# Altium schematic sheet хихема.SchDoc
size A2; SheetNumber: 1; SheetTotal: 6
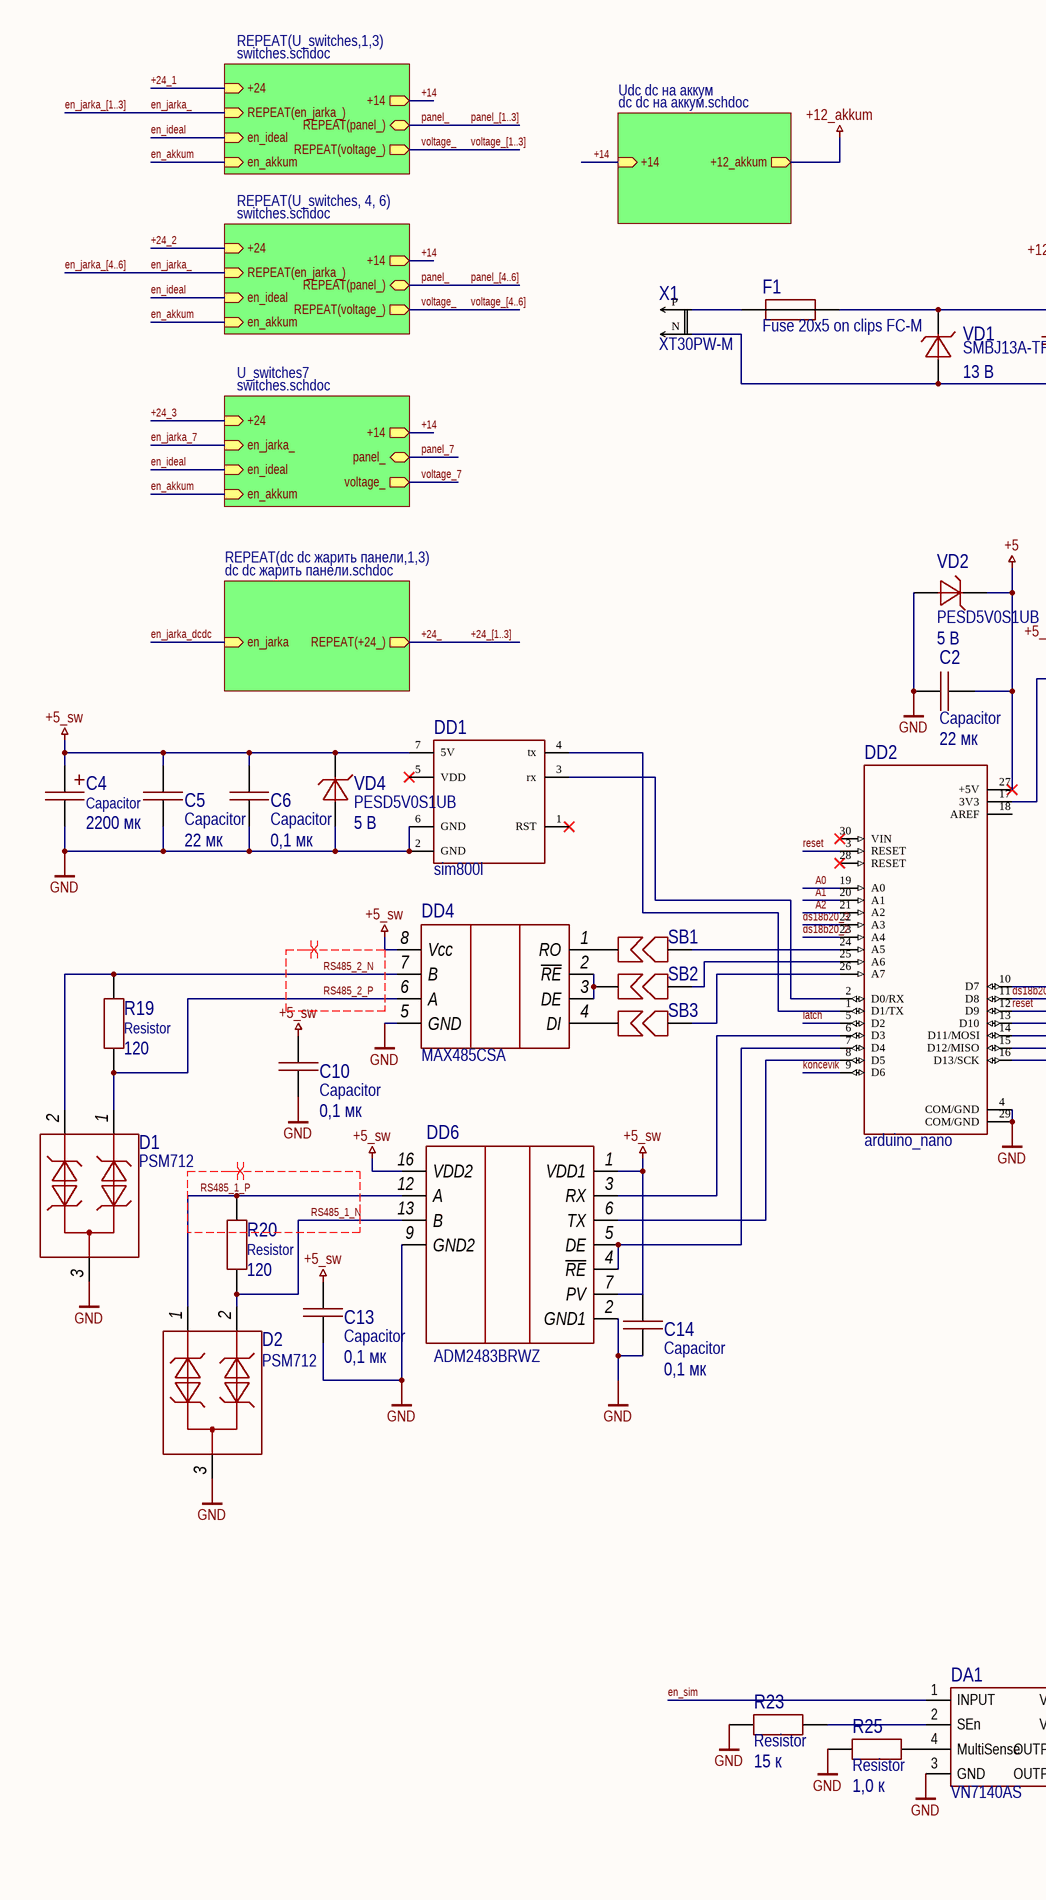
[diagram p0: хихема.SchDoc, left]
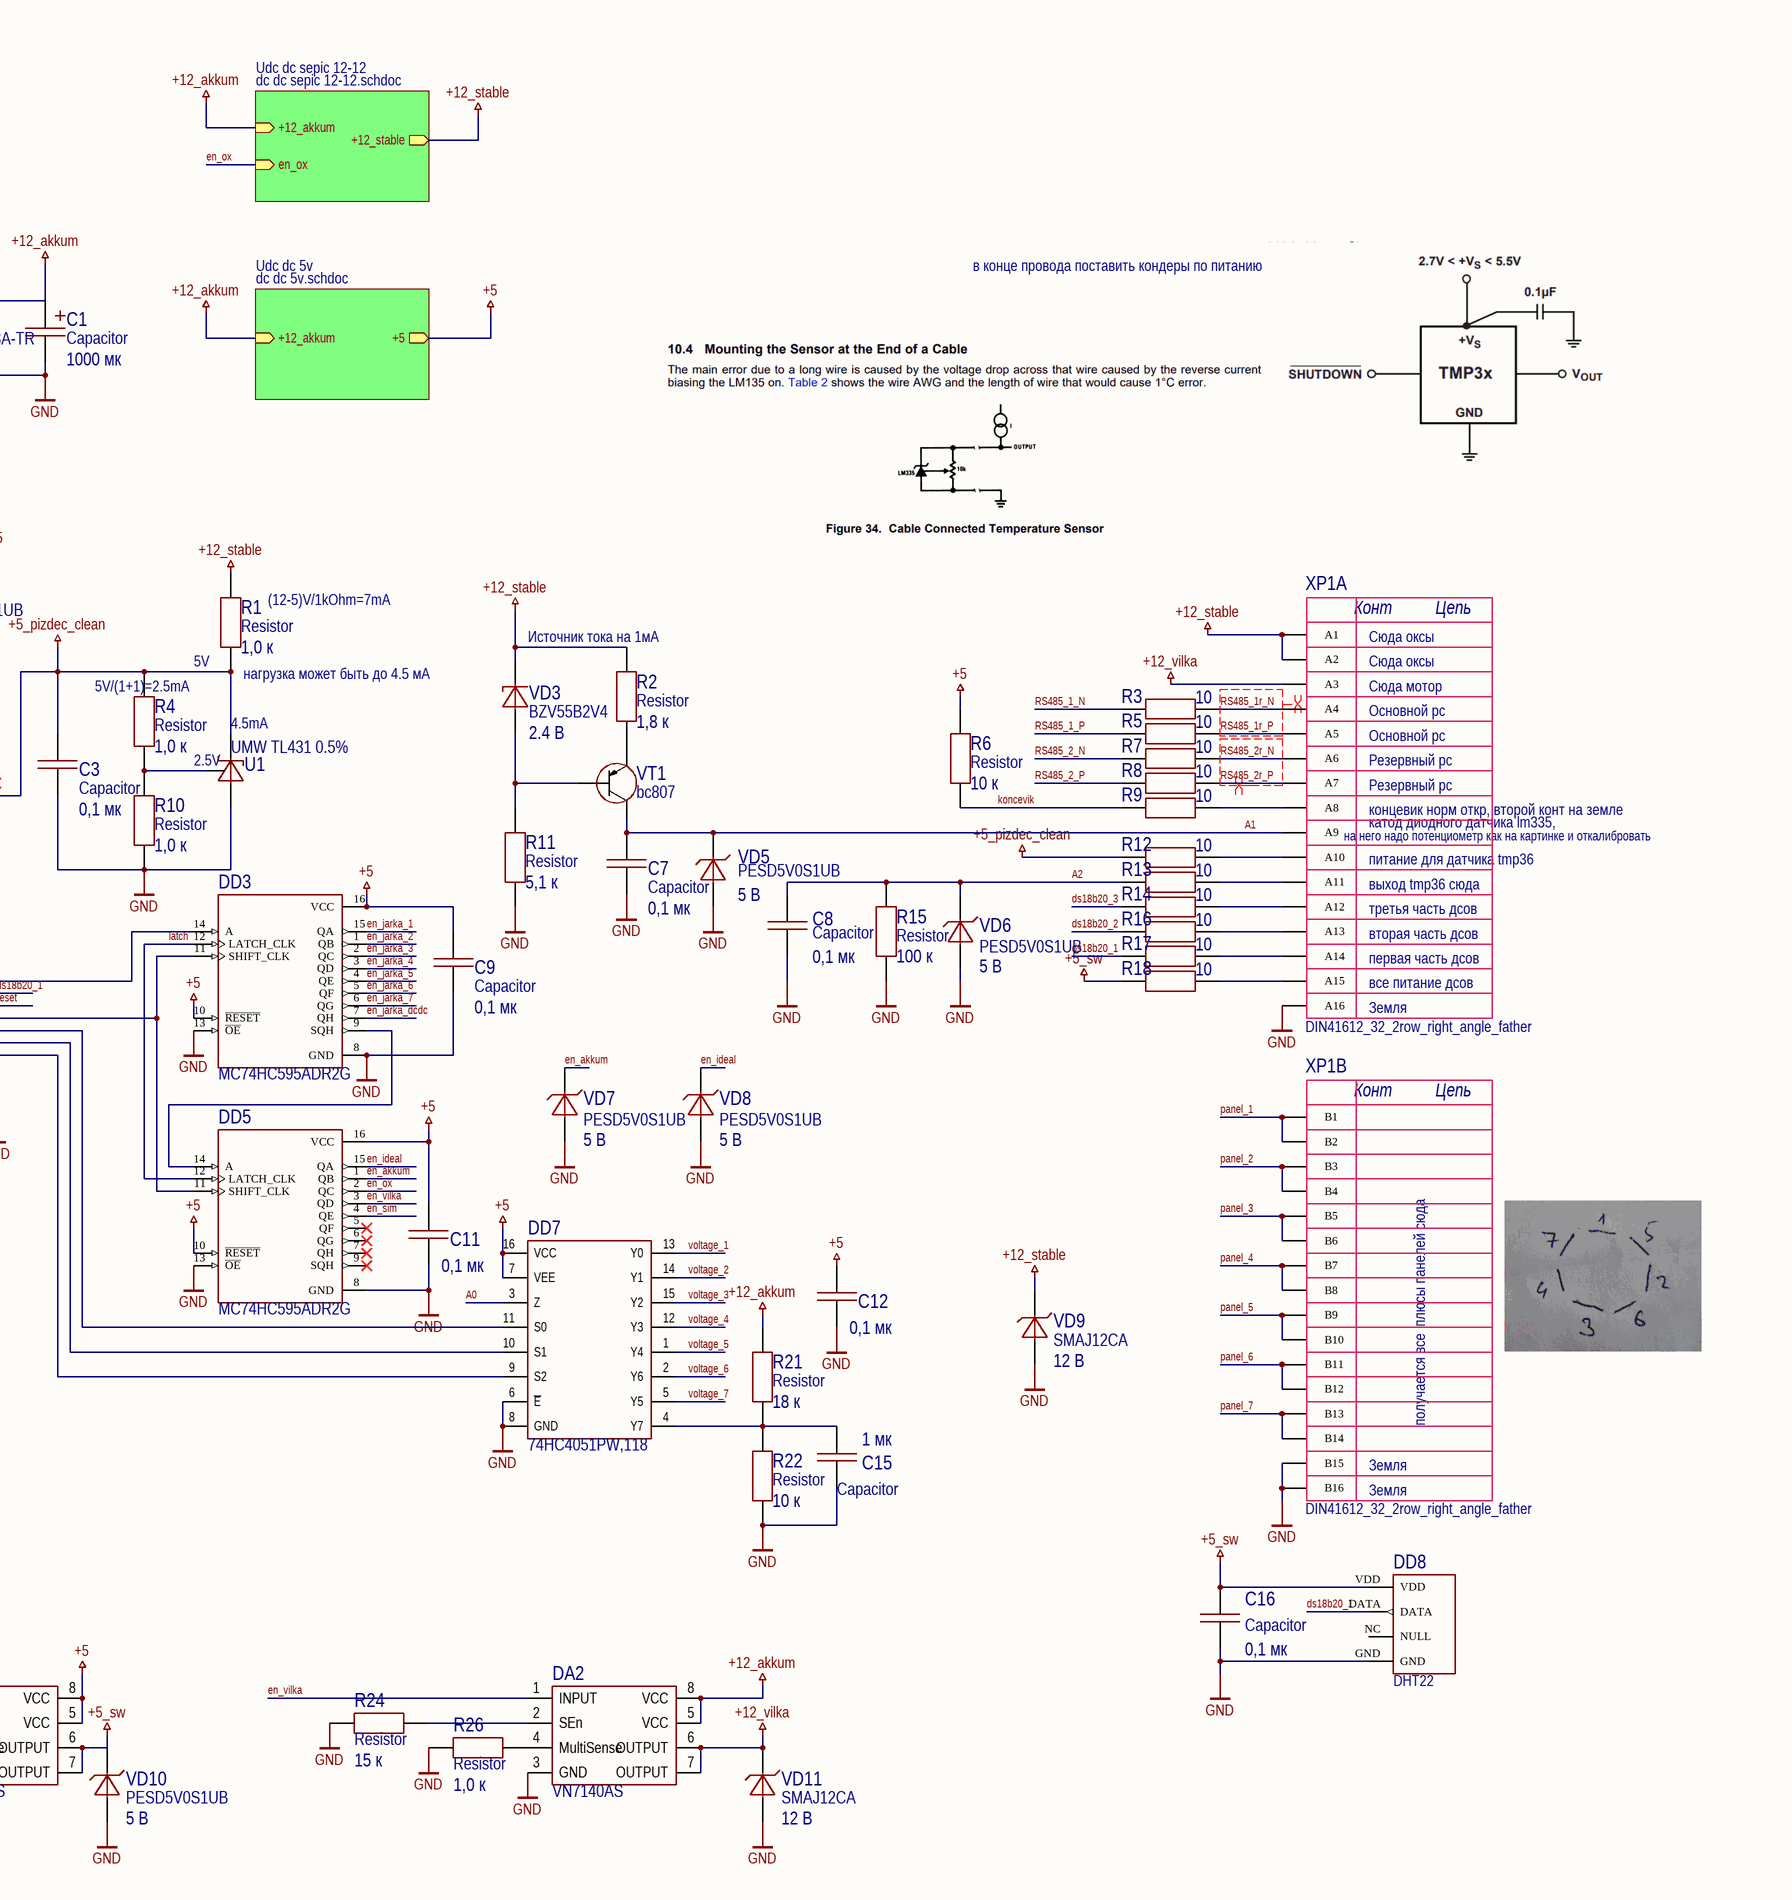
[diagram p1: хихема.SchDoc, right]

## Parts
C1  Capacitor  value 1000 мк  [SMD_cap_12,5x13,5]
C2  Capacitor  value 22 мк  [1210C]
C3  Capacitor  value 0,1 мк  [0603C]
C4  Capacitor  value 2200 мк  [10x20_radial]
C5  Capacitor  value 22 мк  [1210C]
C6  Capacitor  value 0,1 мк  [0603C]
C7  Capacitor  value 0,1 мк  [0603C]
C8  Capacitor  value 0,1 мк  [0603C]
C9  Capacitor  value 0,1 мк  [0603C]
C10  Capacitor  value 0,1 мк  [0603C]
C11  value 0,1 мк  [0603C]  (hidden comment: Capacitor)
C12  value 0,1 мк  [0603C]  (hidden comment: Capacitor)
C13  Capacitor  value 0,1 мк  [0603C]
C14  Capacitor  value 0,1 мк  [0603C]
C15  Capacitor  value 1 мк  [0603C]
C16  Capacitor  value 0,1 мк  [0603C]
D1  PSM712  [SOT23-3]
D2  PSM712  [SOT23-3]
DA1  VN7140AS  [SOP8]
DA2  VN7140AS  [SOP8]
DD1  sim800l  [sim800l]
DD2  arduino_nano  [arduino_nano]
DD3  MC74HC595ADR2G  [SOIC-16]
DD4  MAX485CSA  [SOIC-8]
DD5  MC74HC595ADR2G  [SOIC-16]
DD6  ADM2483BRWZ  [SOIC-16W]
DD7  74HC4051PW,118  [TSSOP-16]
DD8  DHT22  [DHT22]
F1  Fuse 20x5 on clips FC-M  [fuse_20x5_on_clips_FC-M]
R1  Resistor  value 1,0 к  [0603R]
R2  Resistor  value 1,8 к  [0603R]
R3  value 10  [0603R]  (hidden comment: Resistor)
R4  Resistor  value 1,0 к  [0603R]
R5  value 10  [0603R]  (hidden comment: Resistor)
R6  Resistor  value 10 к  [0603R]
R7  value 10  [0603R]  (hidden comment: Resistor)
R8  value 10  [0603R]  (hidden comment: Resistor)
R9  value 10  [0603R]  (hidden comment: Resistor)
R10  Resistor  value 1,0 к  [0603R]
R11  Resistor  value 5,1 к  [0603R]
R12  value 10  [0603R]  (hidden comment: Resistor)
R13  value 10  [0603R]  (hidden comment: Resistor)
R14  value 10  [0603R]  (hidden comment: Resistor)
R15  Resistor  value 100 к  [0603R]
R16  value 10  [0603R]  (hidden comment: Resistor)
R17  value 10  [0603R]  (hidden comment: Resistor)
R18  value 10  [0603R]  (hidden comment: Resistor)
R19  Resistor  value 120  [1206R]
R20  Resistor  value 120  [1206R]
R21  Resistor  value 18 к  [0603R]
R22  Resistor  value 10 к  [0603R]
R23  Resistor  value 15 к  [0603R]
R24  Resistor  value 15 к  [0603R]
R25  Resistor  value 1,0 к  [0603R]
R26  Resistor  value 1,0 к  [0603R]
SB1  SB  [0805SB]  (value not drawn)
SB2  SB  [0805SB]  (value not drawn)
SB3  SB  [0805SB]  (value not drawn)
U1  UMW TL431 0.5%  [SOT23-3]
VD1  SMBJ13A-TR  value 13 В  [SMB]
VD2  PESD5V0S1UB  value 5 В  [SOD523]
VD3  BZV55B2V4  value 2.4 В  [mini_MELF_3.5mm]
VD4  PESD5V0S1UB  value 5 В  [SOD523]
VD5  PESD5V0S1UB  value 5 В  [SOD523]
VD6  PESD5V0S1UB  value 5 В  [SOD523]
VD7  PESD5V0S1UB  value 5 В  [SOD523]
VD8  PESD5V0S1UB  value 5 В  [SOD523]
VD9  SMAJ12CA  value 12 В  [SMA]
VD10  PESD5V0S1UB  value 5 В  [SOD523]
VD11  SMAJ12CA  value 12 В  [SMA]
VT1  bc807  [SOT23-3]
X1  XT30PW-M  [XT30PW-M]
XP1  DIN41612_32_2row_right_angle_father  [DIN41612_32_2row_right_angle_father]  (parts A,B of 2)

## Sub-sheets
REPEAT(dc dc жарить панели,1,3) = dc dc жарить панели.schdoc: REPEAT(+24_) (out), en_jarka (in)
REPEAT(U_switches,1,3) = switches.schdoc: REPEAT(panel_) (bidir), REPEAT(en_jarka_) (in), +14 (out), en_ideal (in), en_akkum (in), +24 (in), REPEAT(voltage_) (out)
REPEAT(U_switches, 4, 6) = switches.schdoc: REPEAT(panel_) (bidir), REPEAT(en_jarka_) (in), +14 (out), +24 (in), en_ideal (in), en_akkum (in), REPEAT(voltage_) (out)
U_switches7 = switches.schdoc: panel_ (bidir), en_jarka_ (in), +14 (out), +24 (in), en_ideal (in), en_akkum (in), voltage_ (out)
Udc dc 5v = dc dc 5v.schdoc: +5 (out), +12_akkum (in)
Udc dc sepic 12-12 = dc dc sepic 12-12.schdoc: +12_akkum (in), +12_stable (out), en_ox (in)
Udc dc на аккум = dc dc на аккум.schdoc: +14 (in), +12_akkum (out)

## Nets
+5: C2.1 C9.2 C11.2 C12.2 DA1.5(VCC) DA1.8(VCC) DD2.27(+5V) DD3.10(~{RESET}) DD3.16(VCC) DD5.10(~{RESET}) DD5.16(VCC) DD7.7(VEE) DD7.16(VCC) R6.2 VD2.2 ; sheet Udc dc 5v/+5
+5_pizdec_clean: C3.2 DD2.17(3V3) R1.1 R4.2 R12.1 U1.2
+5_sw: C4.1 C5.2 C6.2 C10.1 C13.2 C14.2 C16.2 DA1.6(OUTPUT) DA1.7(OUTPUT) DD1.7(5V) DD4.8(Vcc) DD6.1(VDD1) DD6.7(PV) DD6.16(VDD2) DD8.VDD R18.1 VD4.2 VD10.2
+12_akkum: C1.1 DA2.5(VCC) DA2.8(VCC) F1.2 R21.2 VD1.2 ; sheet Udc dc 5v/+12_akkum, sheet Udc dc на аккум/+12_akkum, sheet Udc dc sepic 12-12/+12_akkum
+12_stable: R1.2 R2.2 VD3.2 VD9.2 XP1.A1 XP1.A2 ; sheet Udc dc sepic 12-12/+12_stable
+12_vilka: DA2.6(OUTPUT) DA2.7(OUTPUT) VD11.2 XP1.A3
GND: C1.2 C2.2 C3.1 C4.2 C5.1 C6.1 C7.1 C8.1 C9.1 C10.2 C11.1 C12.1 C13.1 C14.1 C15.1 C16.1 D1.3 D2.3 DA1.3(GND) DA2.3(GND) DD1.2(GND) DD1.6(GND) DD2.4(COM/GND) DD2.29(COM/GND) DD3.8(GND) DD3.13(~{OE}) DD4.5(GND) DD5.8(GND) DD5.13(~{OE}) DD6.2(GND1) DD6.9(GND2) DD7.6(~{E}) DD7.8(GND) DD8.GND R10.1 R11.1 R15.1 R22.1 R23.1 R24.1 R25.1 R26.1 U1.3 VD1.1 VD2.1 VD4.1 VD5.1 VD6.1 VD7.1 VD8.1 VD9.1 VD10.1 VD11.1 X1.N XP1.A16 XP1.B15 XP1.B16
+14: sheet REPEAT(U_switches,1,3)/+14, sheet Udc dc на аккум/+14, sheet REPEAT(U_switches, 4, 6)/+14, sheet U_switches7/+14
+24_: sheet REPEAT(dc dc жарить панели,1,3)/REPEAT(+24_)
+24_1: sheet REPEAT(U_switches,1,3)/+24
+24_2: sheet REPEAT(U_switches, 4, 6)/+24
+24_3: sheet U_switches7/+24
A0: DD2.19(A0) DD7.3(Z)
A1: C7.2 DD2.20(A1) VD5.2 VT1.3 XP1.A9
A2: C8.2 DD2.21(A2) R13.1 R15.2 VD6.2
ds18b20_1: DD2.11(D8) DD8.DATA R17.1
ds18b20_2: DD2.23(A4) R16.1
ds18b20_3: DD2.22(A3) R14.1
en_akkum: DD5.1(QB) VD7.2 ; sheet REPEAT(U_switches,1,3)/en_akkum, sheet REPEAT(U_switches, 4, 6)/en_akkum, sheet U_switches7/en_akkum
en_ideal: DD5.15(QA) VD8.2 ; sheet REPEAT(U_switches,1,3)/en_ideal, sheet REPEAT(U_switches, 4, 6)/en_ideal, sheet U_switches7/en_ideal
en_jarka_: sheet REPEAT(U_switches,1,3)/REPEAT(en_jarka_), sheet REPEAT(U_switches, 4, 6)/REPEAT(en_jarka_)
en_jarka_1: DD3.15(QA)
en_jarka_2: DD3.1(QB)
en_jarka_3: DD3.2(QC)
en_jarka_4: DD3.3(QD)
en_jarka_5: DD3.4(QE)
en_jarka_6: DD3.5(QF)
en_jarka_7: DD3.6(QG) ; sheet U_switches7/en_jarka_
en_jarka_dcdc: DD3.7(QH) ; sheet REPEAT(dc dc жарить панели,1,3)/en_jarka
en_ox: DD5.2(QC) ; sheet Udc dc sepic 12-12/en_ox
en_sim: DA1.1(INPUT) DD5.4(QE)
en_vilka: DA2.1(INPUT) DD5.3(QD)
koncevik: DD2.9(D6) R6.1 R9.1
latch: DD2.5(D2) DD3.12(LATCH_CLK) DD5.12(LATCH_CLK)
panel_: sheet REPEAT(U_switches,1,3)/REPEAT(panel_), sheet REPEAT(U_switches, 4, 6)/REPEAT(panel_)
panel_1: XP1.B1 XP1.B2
panel_2: XP1.B3 XP1.B4
panel_3: XP1.B5 XP1.B6
panel_4: XP1.B7 XP1.B8
panel_5: XP1.B9 XP1.B10
panel_6: XP1.B11 XP1.B12
panel_7: XP1.B13 XP1.B14 ; sheet U_switches7/panel_
reset: DD2.3(RESET) DD2.12(D9)
RS485_1_N: D2.2 DD6.13(B) R3.1 R20.1
RS485_1_P: D2.1 DD6.12(A) R5.1 R20.2
RS485_1r_N: R3.2 XP1.A4
RS485_1r_P: R5.2 XP1.A5
RS485_2_N: D1.2 DD4.7(B) R7.1 R19.2
RS485_2_P: D1.1 DD4.6(A) R8.1 R19.1
RS485_2r_N: R7.2 XP1.A6
RS485_2r_P: R8.2 XP1.A7
voltage_: sheet REPEAT(U_switches,1,3)/REPEAT(voltage_), sheet REPEAT(U_switches, 4, 6)/REPEAT(voltage_)
voltage_1: DD7.13(Y0)
voltage_2: DD7.14(Y1)
voltage_3: DD7.15(Y2)
voltage_4: DD7.12(Y3)
voltage_5: DD7.1(Y4)
voltage_6: DD7.2(Y6)
voltage_7: DD7.5(Y5) ; sheet U_switches7/voltage_
NetC15_2: C15.2 DD7.4(Y7) R21.1 R22.2
NetDA1_2: DA1.2(SEn) R23.2
NetDA1_4: DA1.4(MultiSense) R25.2
NetDA2_2: DA2.2(SEn) R24.2
NetDA2_4: DA2.4(MultiSense) R26.2
NetDD1_3: DD1.3(rx) DD2.2(D0/RX)
NetDD1_4: DD1.4(tx) DD2.1(D1/TX)
NetDD2_6: DD2.6(D3) DD6.3(RX)
NetDD2_7: DD2.7(D4) DD6.4(~{RE}) DD6.5(DE)
NetDD2_8: DD2.8(D5) DD6.6(TX)
NetDD2_10: DD2.10(D7) DD3.14(A)
NetDD2_13: DD2.13(D10) DD3.11(SHIFT_CLK) DD5.11(SHIFT_CLK)
NetDD2_14: DD2.14(D11/MOSI) DD7.11(S0)
NetDD2_15: DD2.15(D12/MISO) DD7.10(S1)
NetDD2_16: DD2.16(D13/SCK) DD7.9(S2)
NetDD2_24: DD2.24(A5) SB1.2
NetDD2_25: DD2.25(A6) SB2.2
NetDD2_26: DD2.26(A7) SB3.2
NetDD3_9: DD3.9(SQH) DD5.14(A)
NetDD4_1: DD4.1(RO) SB1.1
NetDD4_2: DD4.2(~{RE}) DD4.3(DE) SB2.1
NetDD4_4: DD4.4(DI) SB3.1
NetF1_1: F1.1 X1.P
NetR2_1: R2.1 VT1.2
NetR4_1: R4.1 R10.2 U1.1
NetR9_2: R9.2 XP1.A8
NetR11_2: R11.2 VD3.1 VT1.1
NetR12_2: R12.2 XP1.A10
NetR13_2: R13.2 XP1.A11
NetR14_2: R14.2 XP1.A12
NetR16_2: R16.2 XP1.A13
NetR17_2: R17.2 XP1.A14
NetR18_2: R18.2 XP1.A15

Not connected (* = marked no-connect by the designer): DD1 1(RST)* 5(VDD)*; DD2 18(AREF) 28(RESET)* 30(VIN)*; DD5 5(QF)* 6(QG)* 7(QH)* 9(SQH)*; DD8 NC(NULL)

## Buses and harness runs
bus +24_[1..3]
bus en_jarka_[1..3]
bus en_jarka_[4..6]
bus panel_[1..3]
bus panel_[4..6]
bus voltage_[1..3]
bus voltage_[4..6]

## Layout directives
differential pair: RS485_1_N, RS485_1_P, RS485_1r_N, RS485_1r_P, RS485_2_N, RS485_2_P, RS485_2r_N, RS485_2r_P

## Notes on the sheet
- в конце провода поставить кондеры по питанию
- (near R1) (12-5)V/1kOhm=7mA
- (near R1) 5V
- (near R1) нагрузка может быть до 4.5 мА
- Источник тока на 1мА
- Сюда оксы
- (near R4) 5V/(1+1)=2.5mA
- (near U1) 4.5mA
- Основной рс
- Сюда мотор
- (near U1) 2.5V
- концевик норм откр, второй конт на земле
- Резервный рс
- (near XP1) на него надо потенциометр как на картинке и откалибровать
- катод диодного датчика lm335,
- питание для датчика tmp36
- выход tmp36 сюда
- вторая часть дсов
- третья часть дсов
- все питание дсов
- первая часть дсов
- Земля
- плюсы панелей сюда
- получается все
- (in symbol DIN41612_32_2row_right_angle_father, part A) Конт; Цепь
- (in symbol DIN41612_32_2row_right_angle_father, part B) Конт; Цепь

## Library data of the parts
C1 = EEVFK1E102Q: Конденсатор алюминиевый электролитический 1000мкФ 25В 20% Low ESR 1100мА SMD12.5x13.5мм; Tolerance: 20; Voltage (V): 25; Type: Aluminum; Capacity (uF): 1000; Part Number: EEVFK1E102Q
C2 C5 = Capacitor_22u_10_25V_X7R_1210C: Конденсатор; Tolerance: 0,1; Voltage (V): 25; Dielectric: X7R; Capacity (nF): 22000; Part Number: Capacitor_22u_10_25V_X7R_1210C
C3 C6-C14 C16 = Capacitor_0,1u_10_50V_X7R_0603C: Конденсатор; Tolerance: 0,1; Voltage (V): 50; Dielectric: X7R; Capacity (nF): 100; Part Number: Capacitor_0,1u_10_50V_X7R_0603C
C4 = Capacitor_2200u_10V_10x20: Конденсатор радиальный 2200мкФ 10В ±20% 10*19; Tolerance: 20; Voltage (V): 10; Type: Aluminum; Capacity (uF): 2200; Part Number: Capacitor_2200u_10V_10x20
C15 = Capacitor_1u_10_50V_X7R_0603C: Конденсатор; Tolerance: 0,1; Voltage (V): 50; Dielectric: X7R; Capacity (nF): 1000; Part Number: Capacitor_1u_10_50V_X7R_0603C
D1 D2 = PSM712: Защитный диод для линии RS-485; Part Number: PSM712; Interface: RS-485
DA1 DA2 = VN7140AS: Силовой ключ верхнего плеча с аналоговой обратной связью MultiSense автомобильного применения; Part Number: VN7140AS
DD1 = sim800l: Четырехдиапазонный GSM/GPRS модуль, частоты: GSM 850 МГц, EGSM 900 МГц, DCS 1800 МГц и PCS 1900 МГц.; Part Number: sim800l
DD2 = arduino_nano: ардуинка на стойках; MP: Arduino Nano; Check_prices: https://www.snapeda.com/parts/Arduino%20Nano/Arduino/view-part/?ref=eda; Value: *; Availability: Not in stock; Price: None; Package: Non-Standard Arduino; SnapEDA_Link: https://www.snapeda.com/parts/Arduino%20Nano/Arduino/view-part/?ref=snap; MF: Arduino; Part Number: arduino_nano
DD3 DD5 = MC74HC595ADR2G: 8-ми битный сдвиговый регистр; Part Number: MC74HC595ADR2G
DD4 = MAX485CSA: RS-485 приёмопередатчик; Part Number: MAX485CSA
DD6 = ADM2483BRWZ: Прием передатчик RS485 с гальванической развязкой; Part Number: ADM2483BRWZ
DD7 = 74HC4051PW,118: Мультиплексор аналоговый 8 в 1 КМОП кристалл, TSSOP16; Part Number: 74HC4051PW,118
DD8 = DHT22: Датчик температуры и влажности на базе AM2302; Part Number: DHT22
F1 = Fuse 20x5 on clips FC-M: Предохранитель 20*5 на креплениях; Value: {Номинал}; Part Number: Fuse 20x5 on clips FC-M
R1 R4 R10 R25 R26 = Resistor_1.0k_1_0603: Резистор номиналом 1,0 кОм и точностью 1%; Power: *; Part Number: Resistor_1.0k_1_0603; Tolerance: 1%
R2 = Resistor_1.8k_1_0603: Резистор номиналом 1,8 кОм и точностью 1%; Power: *; Part Number: Resistor_1.8k_1_0603; Tolerance: 1%
R3 R5 R7-R9 R12-R14 R16-R18 = Resistor_10_1_0603: Резистор номиналом 10 Ом и точностью 1%; Power: *; Part Number: Resistor_10_1_0603; Tolerance: 1%
R6 R22 = Resistor_10k_1_0603: Резистор номиналом 10 кОм и точностью 1%; Power: *; Part Number: Resistor_10k_1_0603; Tolerance: 1%
R11 = Resistor_5.1k_1_0603: Резистор номиналом 5,1 кОм и точностью 1%; Power: *; Part Number: Resistor_5.1k_1_0603; Tolerance: 1%
R15 = Resistor_100k_1_0603: Резистор номиналом 100 кОм и точностью 1%; Power: *; Part Number: Resistor_100k_1_0603; Tolerance: 1%
R19 R20 = Resistor_120_1_0603: Резистор номиналом 120 Ом и точностью 1%; Power: *; Part Number: Resistor_120_1_0603; Tolerance: 1%
R21 = Resistor_18k_1_0603: Резистор номиналом 18 кОм и точностью 1%; Power: *; Part Number: Resistor_18k_1_0603; Tolerance: 1%
R23 R24 = Resistor_15k_1_0603: Резистор номиналом 15 кОм и точностью 1%; Power: *; Part Number: Resistor_15k_1_0603; Tolerance: 1%
SB1-SB3 = SB: Solder bridge, мост припоя, запаиваемая перемычка, net tie, jumper; Part Number: SB
U1 = UMW TL431 0.5%: Источник опорного напряжения , программируемый стабилитрон [SOT-23-3]; Part Number: UMW TL431 0.5%
VD1 = SMBJ13A-TR: Защитный диод на 13 В, рассеиваемая мощность 600 Вт; Voltage nominal (V): 13; Power (W): 600; Part Number: SMBJ13A-TR
VD2 VD4-VD8 VD10 = PESD5V0S1UB: Защитный диод на 5 В, рассеиваемая мощность 330 Вт; Voltage nominal (V): 5; Power (W): 330; Part Number: PESD5V0S1UB
VD3 = BZV55B2V4: Стабилитрон на 2.4 В, рассеиваемая мощность 0.5 Вт; Voltage nominal (V): 2.4; Current nominal (mA): 5; Power (W): 0.3; Part Number: BZV55B2V4
VD9 VD11 = SMAJ12CA: Защитный диод на 12 В, рассеиваемая мощность 400 Вт; Voltage nominal (V): 12; Power (W): 400; Part Number: SMAJ12CA
VT1 = bc807: Биполярный транзистор PNP 45В 0.5А 0.31Вт; Part Number: bc807; Напряжение С-И/К-Э: 45 В; Ток макс#: 0.5 А
X1 = XT30PW-M: 30 А (15 продолжительно), 2 контакта разъем угловой отец; Part Number: XT30PW-M
XP1 = DIN41612_32_2row_right_angle_father: DIN41612R (DS1118-32M0R23), Разъем (вилка) тип B 32pin (2х16), шаг 2.54мм двухрядный угловой (ряд АВ); Part Number: DIN41612_32_2row_right_angle_father